# EasyEDA schematic schematic_rs232_ttl_converter.json
TITLE: TTL to DIN; REV: 1.0; Date: 2021-11-24; Sheet: 1/1; Company: UPSSITECH
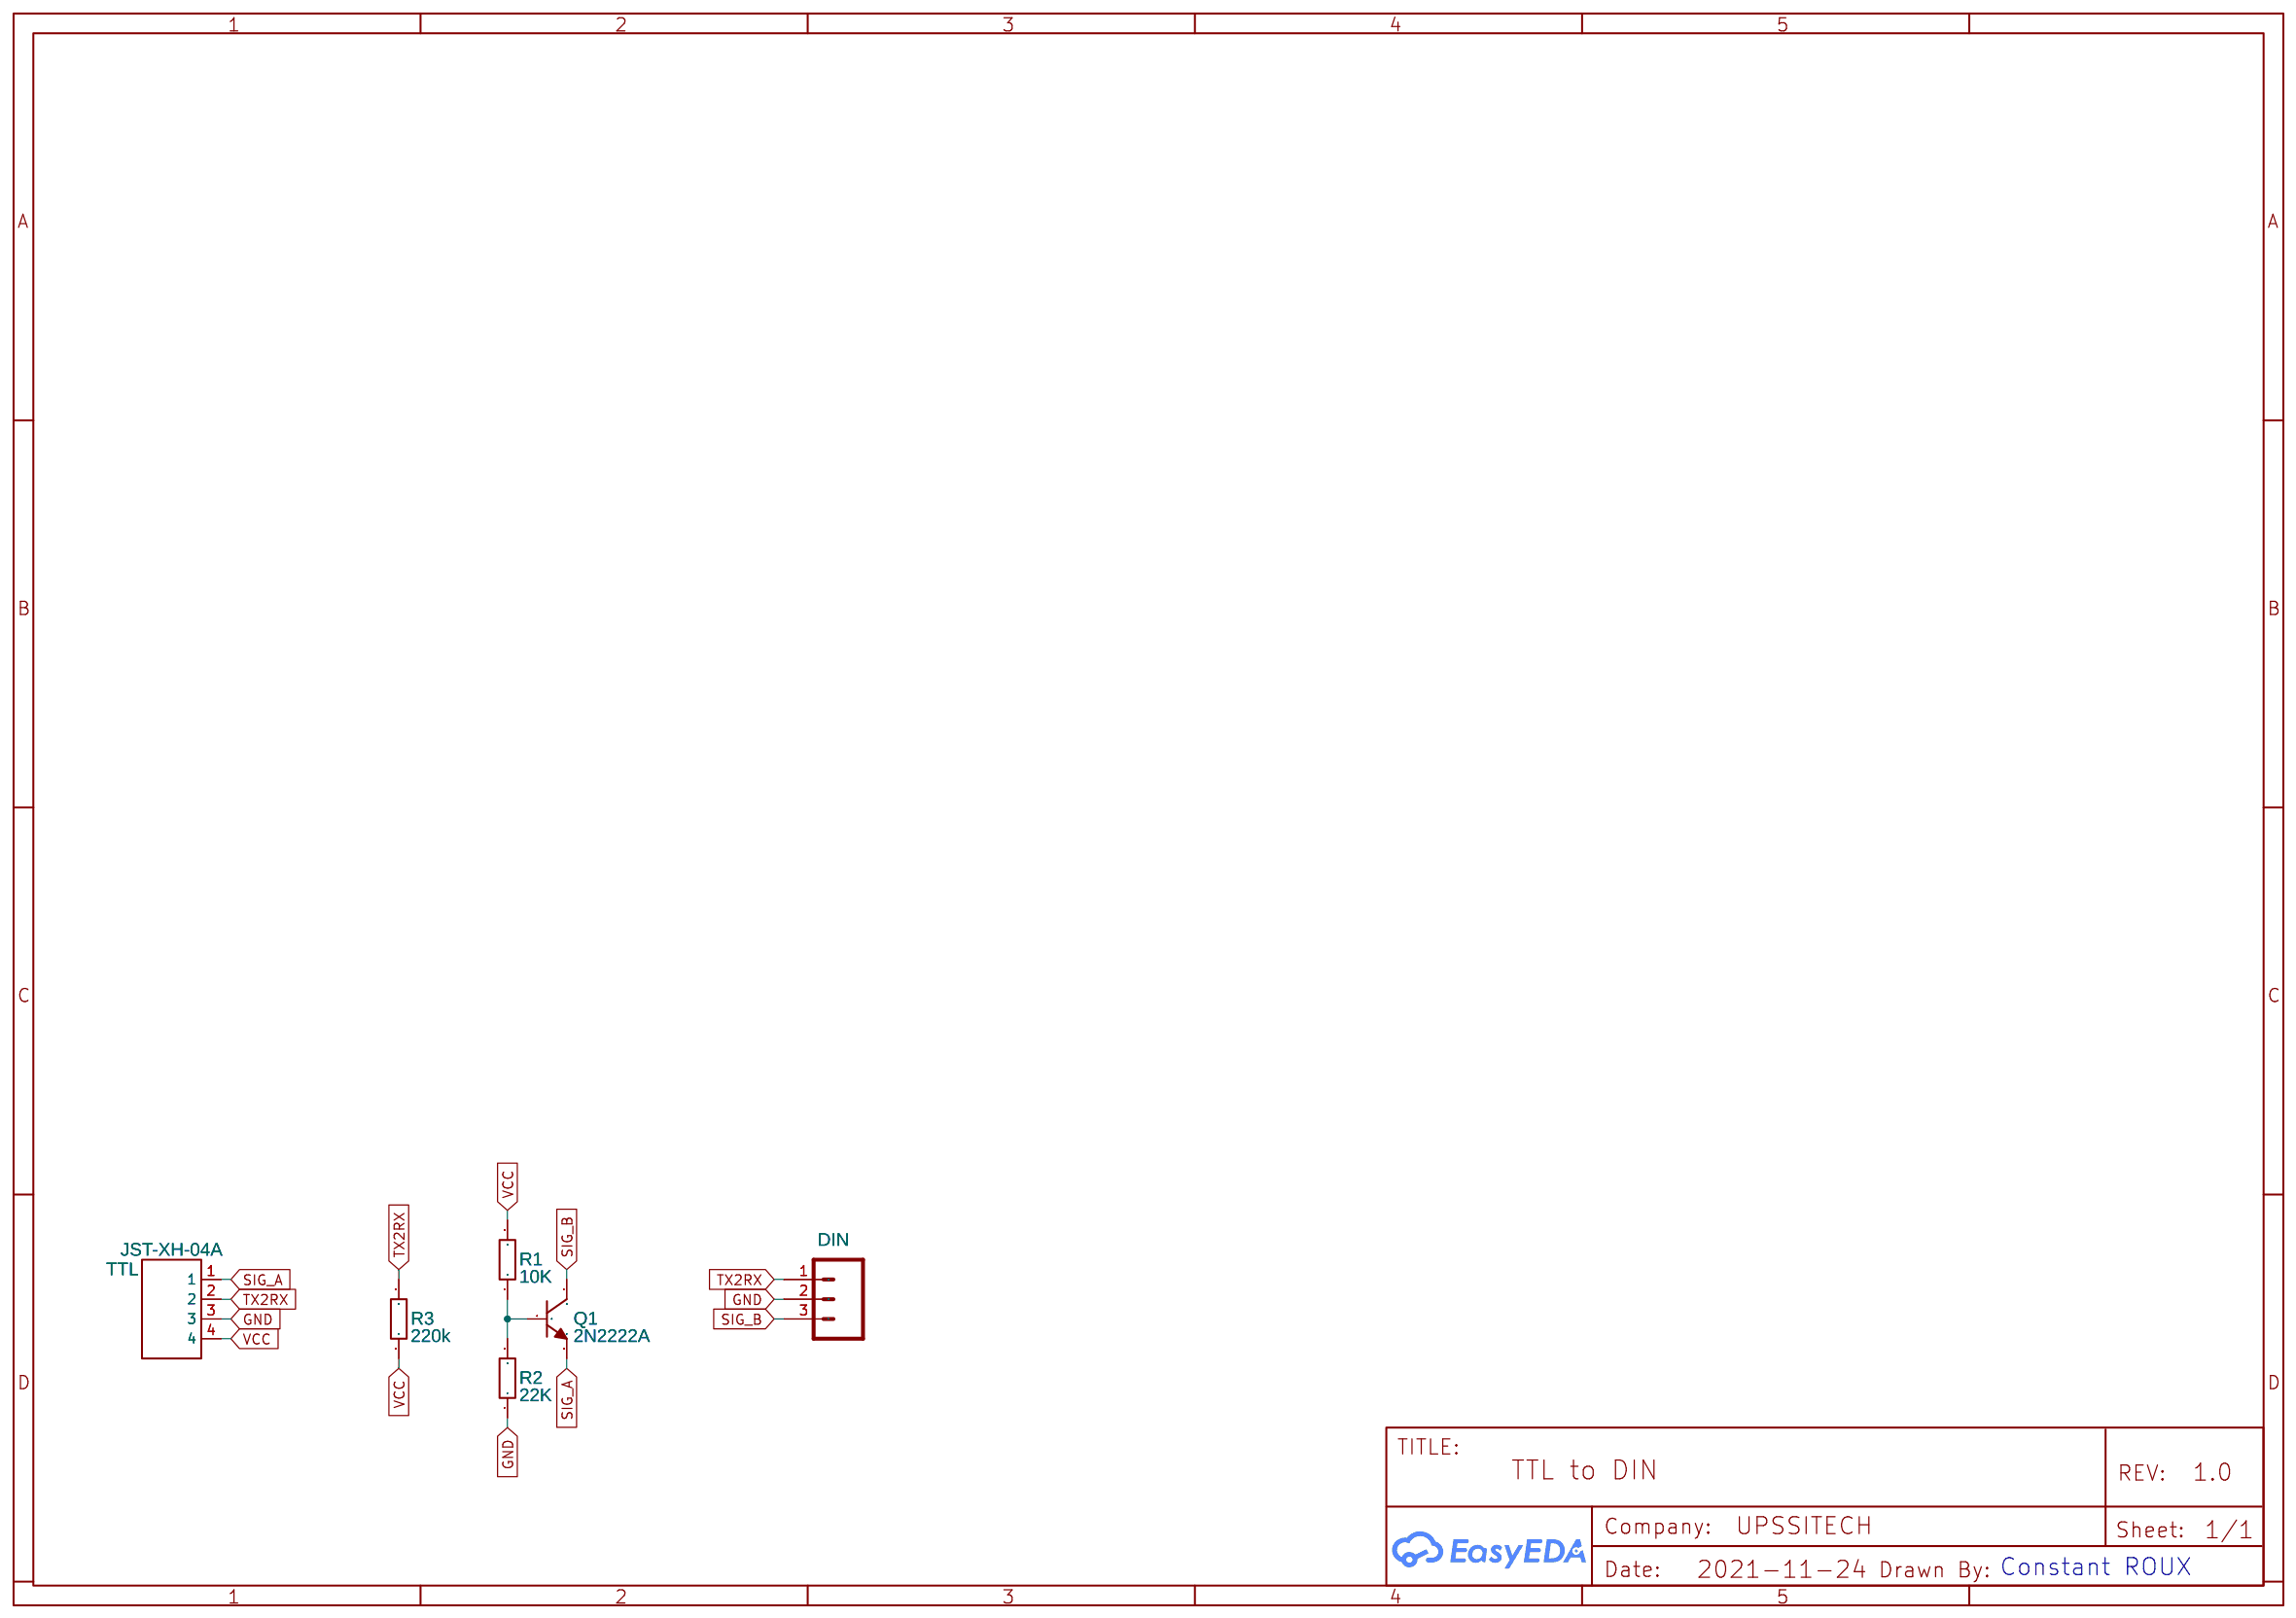
[diagram p0: schematic sheet]

## Parts
DIN  JST-XH-1X03-2.50MM-THM  [JST_XH_1X03_2.50MM_THM]
Q1  2N2222A  [TO-92-3_L4.8-W3.7-P2.54-R]
R1  10K  [RES-TH_BD2.2-L6.5-P10.50-D0.6]
R2  22K  [RES-TH_BD2.2-L6.5-P10.50-D0.6]
R3  220k  [RES-TH_BD2.2-L6.5-P10.50-D0.6]
TTL  JST-XH-04A  [JST-04-ARDUMOWER]

## Library data of the parts
DIN = JST-XH-1X03-2.50MM-THM: sourceId: Y4gQNLJH3; Supplier Part: 455-2248-ND; Supplier: Digi-Key
Q1 = 2N2222A: Supplier: LCSC; Supplier Part: C358533; Manufacturer: Foshan Blue Rocket Elec; Contributor: LCSC; JLCPCB Part Class: Extended Part
R1-R3 = CFR0W4J0102A50: Supplier: LCSC; Manufacturer: UniOhm; Supplier Part: C61293; JLCPCB Part Class: Extended Part
TTL = JST-XH-04A: Contributor: hgvprojects

## Nets
GND: DIN.2 R2.1 TTL.3
VCC: R1.2 R3.1 TTL.4
SIG_A: Q1.3(E) TTL.1
SIG_B: DIN.3 Q1.1(C)
TX2RX: DIN.1 R3.2 TTL.2
Net-(Q1-2): Q1.2(B) R1.1 R2.2

## Notes on the sheet
- Constant ROUX
